# EAGLE design DigitalInput (EAGLE 6.5.0)
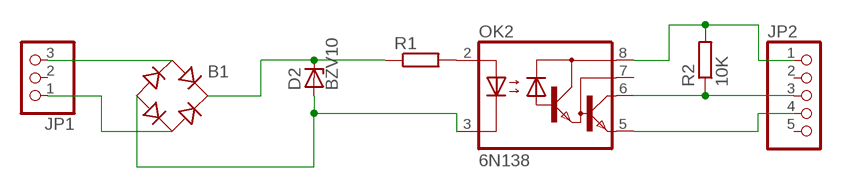
[diagram p0: schematic, sheet 1]

## Parts
B1  B-DIL  [B-DIL]
D2  BZV10  [DO34Z7]
JP1  PINHD-1X3  [1X03]
JP2  PINHD-1X5  [1X05]
OK2  6N138  [DIL08]
R1  R-EU_0204/7  [0204/7]
R2  10K  R-EU_0207/5V  [0207/5V]

## Nets
N$1: JP2.1 OK2.8(VCC) R2.2
N$2: JP2.4 OK2.5(GND)
N$3: JP2.3 OK2.6(VO) R2.1
N$4: B1.AC1 JP1.3
N$5: B1.AC2 JP1.1
N$6: OK2.2(A) R1.2
N$9: B1.- D2.A OK2.3(C)
N$10: B1.+ D2.C R1.1
Unconnected: JP1.2 JP2.2 JP2.5 OK2.7(VB)

## Library data of the parts
B1 = rectifier:B-DIL: RECTIFIER
D2 = diode:BZV10: Z DIODE
JP1 = pinhead:PINHD-1X3: PIN HEADER
JP2 = pinhead:PINHD-1X5: PIN HEADER
OK2 = optocoupler:6N138: MOTOROLA OPTO COUPLER; MF: VISHAY/TELEFUNKEN; MPN: 6N138; OC_FARNELL: 9860150; OC_NEWARK: 35K5294
R1 R2 = resistor:R-EU_: RESISTOR, European symbol

## Board
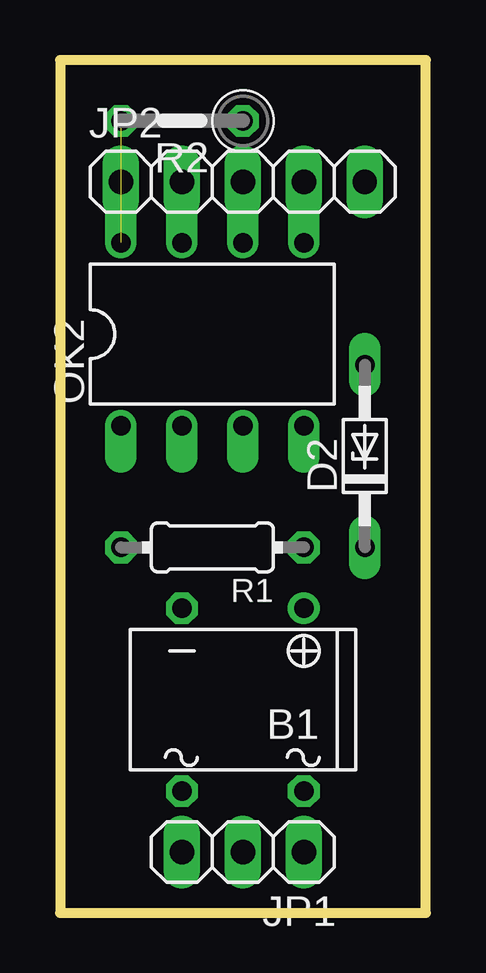
[diagram p1: board, top side]
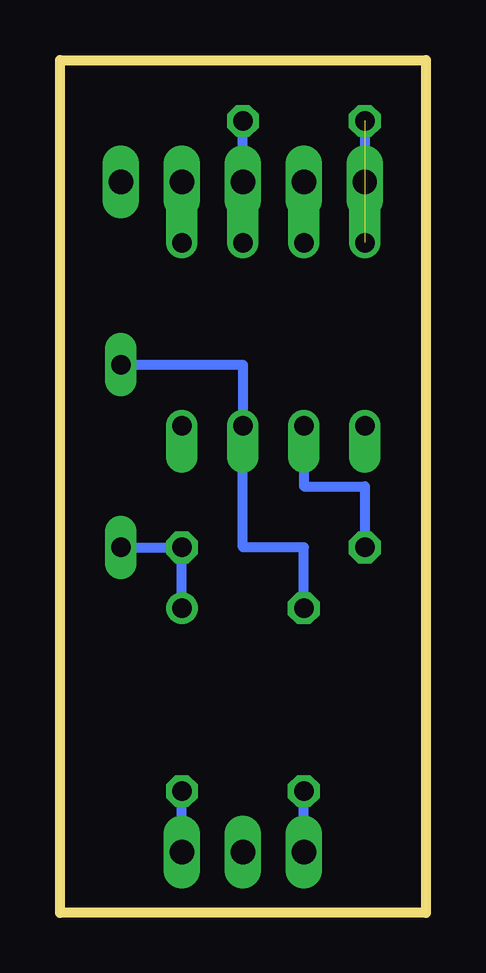
[diagram p2: board, bottom side, seen from below]

Size 15.24 x 35.56 mm. Coordinates in mm from the lower left corner, seen from the top.
Outline: 0,0 15.24,0 15.24,35.56 0,35.56 0,0
Copper layers (1*16): Top 0.035mm / dielectric 1.5mm / Bottom 0.035mm
Design rules "default": minimum track width 10mil, minimum drill 24mil, track to track 8mil, track to pad 8mil, pad to pad 8mil, via to via 8mil, smd to smd 8mil, copper to edge 40mil, drill to drill 8mil, minimum pad ring 10mil, minimum via ring 8mil, stop-mask expansion 4mil, vias tented up to drill 0mil, thermal gap 10mil

### Footprints (pad centres in the part's own frame; a part is rotated, then mirrored left to right if it is on the bottom)
B-DIL = drill 0.813: + -2.54,-3.81 | drill 0.813 octagon: - 2.54,-3.81; AC1 2.54,3.81; AC2 -2.54,3.81
DO34Z7 = drill 0.813 long: A 3.81,0; C -3.81,0
1X03 = drill 1.016 long: 1 -2.54,0; 2 0,0; 3 2.54,0
1X05 = drill 1.016 long: 1 -5.08,0; 2 -2.54,0; 3 0,0; 4 2.54,0; 5 5.08,0
DIL08 = drill 0.813 offset: 1 -3.81,-3.81; 2 -1.27,-3.81; 3 1.27,-3.81; 4 3.81,-3.81; 5 3.81,3.81; 6 1.27,3.81; 7 -1.27,3.81; 8 -3.81,3.81
0204/7 = drill 0.813 octagon: 1 -3.81,0; 2 3.81,0
0207/5V = drill 0.813 octagon: 1 -2.54,0; 2 2.54,0

### Placement (x,y rotation side)
B1  7.62,8.89 180 top
D2  12.7,19.05 90 top
JP1  7.62,2.54 180 top
JP2  7.62,30.48 0 top
OK2  6.35,24.13 0 top
R1  6.35,15.24 180 top
R2  5.08,33.02 180 top

### Tracks (layer width: path | path; a pad name or v marks a point on that pad's centre or on a via)
N$1  (1 unrouted)
  Bottom 0.406: OK2.8 JP2.1 R2.2
N$2
  Bottom 0.406: OK2.5 JP2.4
N$3
  Bottom 0.406: JP2.3 OK2.6 R2.1
N$4
  Bottom 0.406: JP1.3 B1.AC1
N$5
  Bottom 0.406: JP1.1 B1.AC2
N$6
  Bottom 0.406: OK2.2 5.08,17.78 2.54,17.78 R1.2
N$9
  Bottom 0.406: B1.- 5.08,15.24 7.62,15.24 OK2.3 7.62,22.86 D2.A
N$10
  Bottom 0.406: B1.+ R1.1 D2.C